# Altium schematic sheet Logic.SchDoc
size A
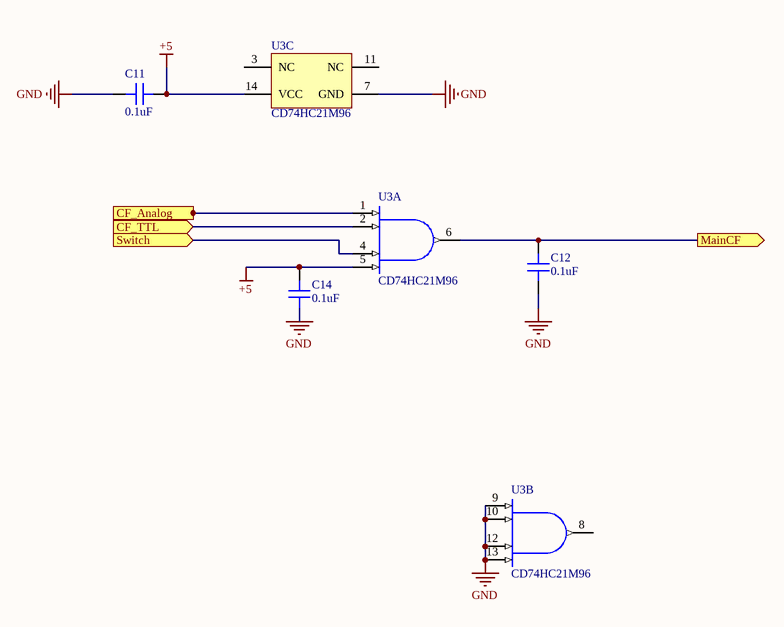
[diagram p0: Logic.SchDoc]

## Parts
C11  0.1uF  [CAP 0805/2012]
C12  0.1uF  [CAP 0805/2012]
C14  0.1uF  [CAP 0805/2012]
U3  CD74HC21M96  [D0014A_N]  (parts A,B,C of 3)

## Ports
CF_Analog (in), CF_TTL (in), MainCF (out), Switch (in)

## Nets
+5: C11.1 C14.1 U3.5(1D) U3.14(VCC)
GND: C11.2 C12.2 C14.2 U3.7(GND) U3.9(2A) U3.10(2B) U3.12(2C) U3.13(2D)
CF_Analog: U3.1(1A) ; port CF_Analog
CF_TTL: U3.2(1B) ; port CF_TTL
MainCF: C12.1 U3.6(1Y) ; port MainCF
Switch: U3.4(1C) ; port Switch

Not connected (* = marked no-connect by the designer): U3 3(NC) 8(2Y) 11(NC)

## Library data of the parts
C11 C12 C14 = CL21B104KACNNNC: CAP CER 0.1UF 25V X7R 0805; Manufacturer: Samsung Electro-Mechanics America, Inc.; TemperatureRange: -55C ~ 125C; Tolerance: 10%; Value: 0.1uF; Part Number: CL21B104KACNNNC; PartId: 5699; Supplier 1: Digi-Key; Supplier Part Number 1: 1276-1099-2-ND; ComponentLink1Description: Datasheet; ComponentLink1URL: http://www.samsungsem.com/kr/support/product-search/mlcc/CL21B104KACNNNC.jsp; ComponentLink2Description: Digi-Key listing; ComponentLink2URL: http://digikey.com/product-detail/en/CL21B104KACNNNC/1276-1099-2-ND/3886757; TemperatureCoefficient: X7R; Voltage: 25V; Price: 0.0099; Device Package: 0805 (2012 Metric); Type: -
U3 = CMP-0777-00096-3: High Speed CMOS Logic Dual 4-Input AND Gates, D0014A, LARGE T&R; Manufacturer: Texas Instruments; Rating: Catalog; F @ Nom Voltage(Max)(Mhz): 70; Output Drive (IOL/IOH)(Max)(mA): -5.2/5.2; Technology Family: HC; Bits(#): 2; Voltage(Nom)(V): 5; ICC @ Nom Voltage(Max)(mA): 0.02; Schmitt Trigger: No; tpd @ Nom Voltage(Max)(ns): 28; VCC(Max)(V): 6; Operating Temperature Range(C): -55 to 125; Input Type: CMOS; DatasheetVersion: SCHS131C; Generic Part Number: CD74HC21; PackageReference: D0014A; VCC(Min)(V): 2; Output Type: CMOS